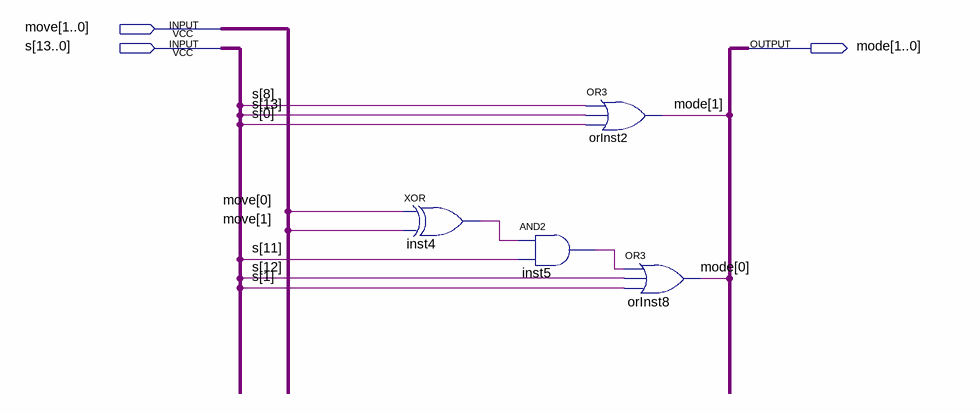
[diagram p0: schematic sheet]
// Quartus schematic CursorMode.bdf as structural Verilog: 4 symbols, 3 pins
module CursorMode (
  input  [1:0] move,
  input  [13:0] s,
  output [1:0] mode
);

  wire inst4_out, inst5_out;

  xor inst4 (inst4_out, move[0], move[1]);
  and inst5 (inst5_out, inst4_out, s[11]);
  or orInst2 (mode[1], s[8], s[13], s[0]);
  or orInst8 (mode[0], inst5_out, s[12], s[1]);
endmodule
